# Altium schematic sheet Schematic1.schdoc
size 264 x 264 mm; Symbol: Drawing-Symbol_A4; Device: Drawing-Symbol_A4; @Project Name: AudioDeck; @Page Count: 1; @Update Date: 2026-04-30; @Create Date: 2026-04-28; @Schematic Name: Schematic1; @Page No: 1; @Page Name: P1; Company: EasyEDA.com; Version: V1.0; Page Size: A4; @Create Time: 20:01:22; @Update Time: 01:47:28; Width: 1000; Height: 1000; Region Start: 1; X Region Count: 6; Y Region Count: 4; Blade Width: 10; Title Block Position: 3; @Board Name: Board1
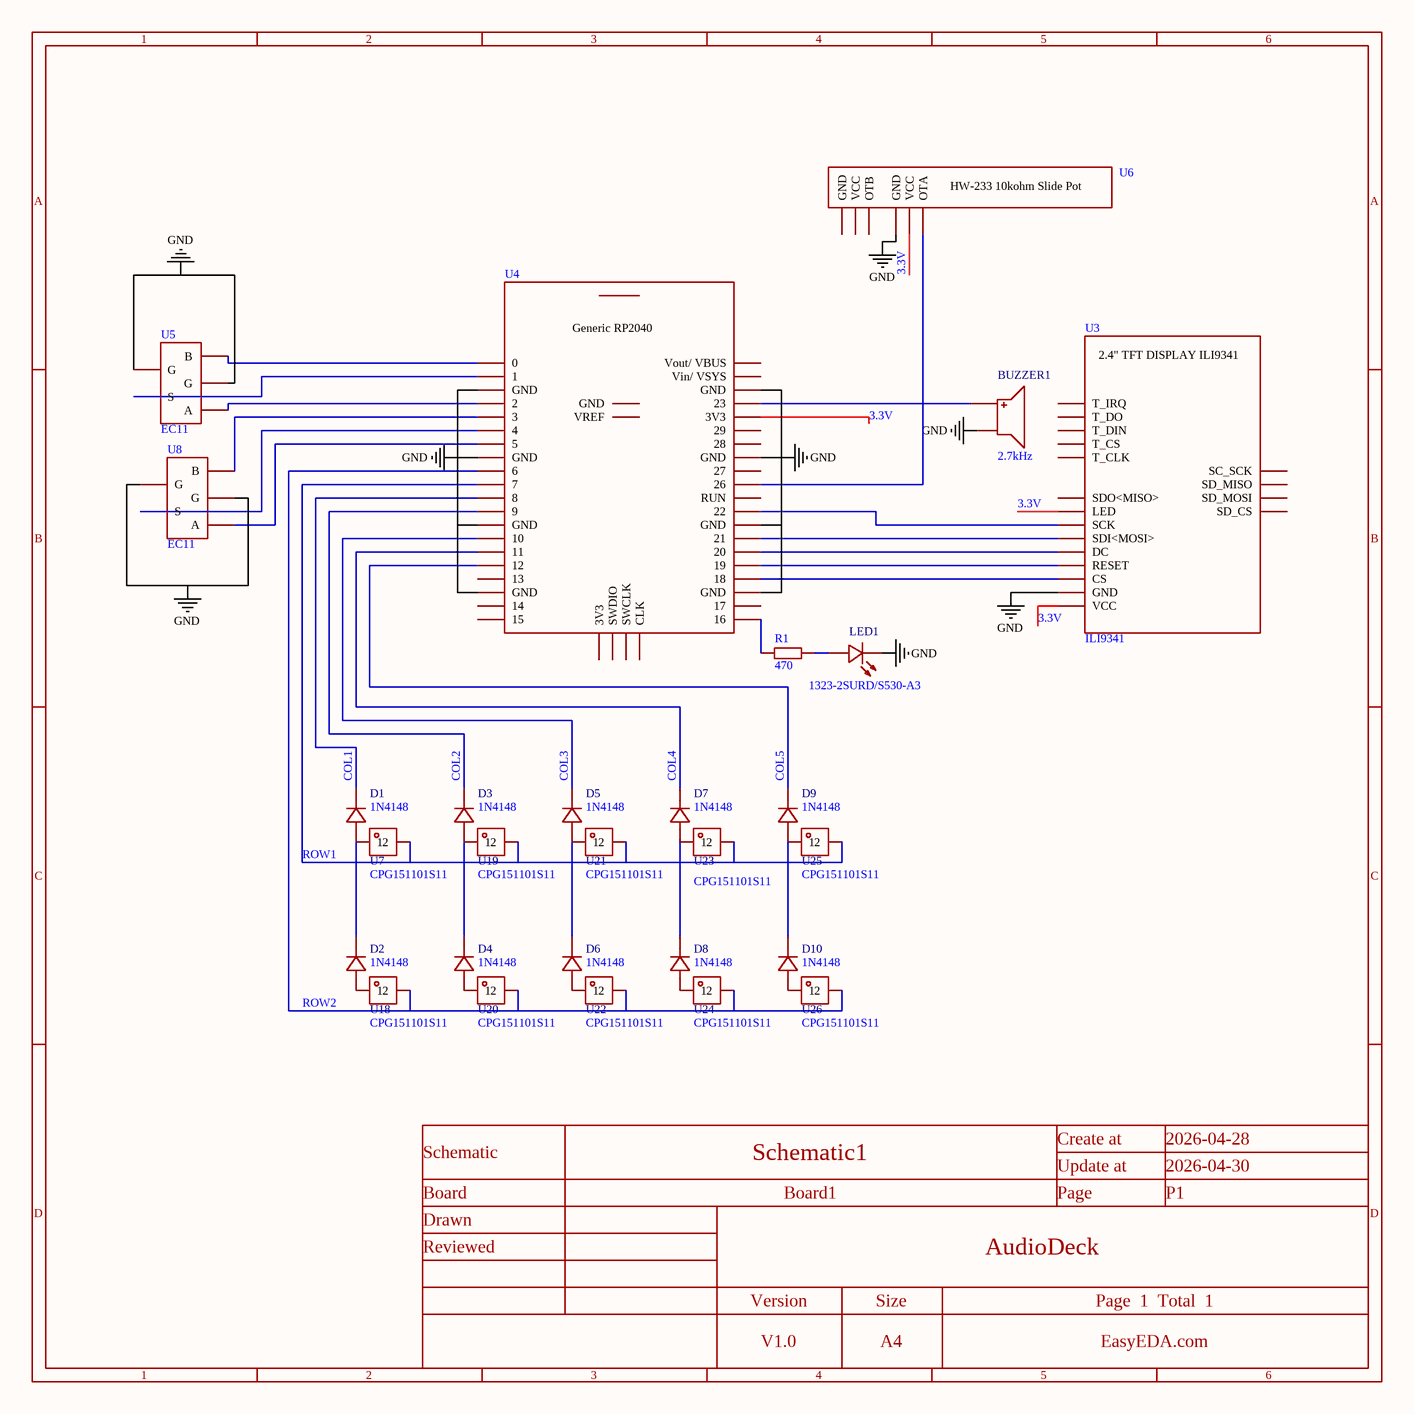
[diagram p0: Schematic1.schdoc]

## Parts
BUZZER1  2.7kHz  [BUZ-TH_BD9.0-P4.00-D0.6-FD]
D1  1N4148  [DO-35_BD1.7-L3.6-P10.00-D0.5-RD]
D2  1N4148  [DO-35_BD1.7-L3.6-P10.00-D0.5-RD]
D3  1N4148  [DO-35_BD1.7-L3.6-P10.00-D0.5-RD]
D4  1N4148  [DO-35_BD1.7-L3.6-P10.00-D0.5-RD]
D5  1N4148  [DO-35_BD1.7-L3.6-P10.00-D0.5-RD]
D6  1N4148  [DO-35_BD1.7-L3.6-P10.00-D0.5-RD]
D7  1N4148  [DO-35_BD1.7-L3.6-P10.00-D0.5-RD]
D8  1N4148  [DO-35_BD1.7-L3.6-P10.00-D0.5-RD]
D9  1N4148  [DO-35_BD1.7-L3.6-P10.00-D0.5-RD]
D10  1N4148  [DO-35_BD1.7-L3.6-P10.00-D0.5-RD]
LED1  1323-2SURD/S530-A3  [LED-TH_BD5.0-P2.54-L-RD]
R1  470  [R0603]
U3  ILI9341
U4  (no value)
U5  EC11
U6  (no value)
U7  CPG151101S11  [TH_L11.0-W5.9-KS-2P02B01-01]
U8  EC11
U18  CPG151101S11  [TH_L11.0-W5.9-KS-2P02B01-01]
U19  CPG151101S11  [TH_L11.0-W5.9-KS-2P02B01-01]
U20  CPG151101S11  [TH_L11.0-W5.9-KS-2P02B01-01]
U21  CPG151101S11  [TH_L11.0-W5.9-KS-2P02B01-01]
U22  CPG151101S11  [TH_L11.0-W5.9-KS-2P02B01-01]
U23  CPG151101S11  [TH_L11.0-W5.9-KS-2P02B01-01]
U24  CPG151101S11  [TH_L11.0-W5.9-KS-2P02B01-01]
U25  CPG151101S11  [TH_L11.0-W5.9-KS-2P02B01-01]
U26  CPG151101S11  [TH_L11.0-W5.9-KS-2P02B01-01]

## Nets
GND: BUZZER1.2 LED1.1(-) U3.2(GND) U4.3(GND) U4.8(GND) U4.13(GND) U4.18(GND) U4.23(GND) U4.28(GND) U4.33(GND) U4.38(GND) U5.1(G) U5.4(G) U6.4(GND) U8.1(G) U8.4(G)
3.3V: U3.1(VCC) U3.8(LED) U4.25(3V3) U6.5(VCC)
COL1: D1.1(C) U4.11(8)
COL2: D3.1(C) U4.12(9)
COL3: D5.1(C) U4.14(10)
COL4: D7.1(C) U4.15(11)
COL5: D9.1(C) U4.16(12)
ROW1: U4.10(7) U7.2 U19.2 U21.2 U23.2 U25.2
ROW2: U4.9(6) U18.2 U20.2 U22.2 U24.2 U26.2
NetBUZZER1_1: BUZZER1.1 U4.24(23)
NetD1_2: D1.2(A) D2.1(C) U7.1
NetD2_2: D2.2(A) U18.1
NetD3_2: D3.2(A) D4.1(C) U19.1
NetD4_2: D4.2(A) U20.1
NetD5_2: D5.2(A) D6.1(C) U21.1
NetD6_2: D6.2(A) U22.1
NetD7_2: D7.2(A) D8.1(C) U23.1
NetD8_2: D8.2(A) U24.1
NetD9_2: D9.2(A) D10.1(C) U25.1
NetD10_2: D10.2(A) U26.1
NetLED1_2: LED1.2(+) R1.2
NetR1_1: R1.1 U4.40(16)
NetU3_3: U3.3(CS) U4.37(18)
NetU3_4: U3.4(RESET) U4.36(19)
NetU3_5: U3.5(DC) U4.35(20)
NetU3_6: U3.6(SDI<MOSI>) U4.34(21)
NetU3_7: U3.7(SCK) U4.32(22)
NetU4_1: U4.1(0) U5.5(B)
NetU4_2: U4.2(1) U5.2(S)
NetU4_4: U4.4(2) U5.3(A)
NetU4_5: U4.5(3) U8.5(B)
NetU4_6: U4.6(4) U8.2(S)
NetU4_7: U4.7(5) U8.3(A)
NetU4_30: U4.30(26) U6.6(OTA)

Not connected (* = marked no-connect by the designer): U3 9(SDO<MISO>) 10(T_CLK) 11(T_CS) 12(T_DIN) 13(T_DO) 14(T_IRQ) 15(SD_CS) 16(SD_MOSI) 17(SD_MISO) 18(SC_SCK); U4 17(13) 19(14) 20(15) 21(Vout/_VBUS) 22(Vin/_VSYS) 26(29) 27(28) 29(27) 31(RUN) 39(17) 41(GND) 42(VREF) 43(3V3) 44(SWDIO) 45(SWCLK) 46(CLK); U6 1(GND) 2(VCC) 3(OTB)

## Notes on the sheet
- 1
- 2
- 3
- 4
- 5
- 6
- A
- B
- C
- Schematic
- Schematic1
- Create at
- Update at
- 2026-04-28
- 2026-04-30
- D
- Board
- Drawn
- Board1
- Page
- P1
- Reviewed
- Version
- Size
- AudioDeck
- Page  1  Total  1
- V1.0
- A4
- EasyEDA.com
- (in symbol HW-233 10k Slide Pot) HW-233 10kohm Slide Pot
- (in symbol ILI9341) 2.4" TFT DISPLAY ILI9341
- (in symbol RP2040-GENERIC-ALEXP) Generic RP2040

## Library data of the parts
BUZZER1 = QMB-09B-03: Manufacturer: 华能; Add into BOM: yes; Driver Circuitry: Passive (Externally Driven); Voltage - Supply: 2V~5V; Sound Pressure Level(SPL): 85dB; Symbol: QMB-09B-03; Device: QMB-09B-03; LCSC Part Name: 无源蜂鸣器QMB-09B-03; Supplier Part: C96256; Manufacturer Part: QMB-09B-03; Supplier Footprint: 插件,D=9mm; JLCPCB Part Class: Extended Part; Datasheet: https://item.szlcsc.com/datasheet/QMB-09B-03/97460.html; Supplier: LCSC; Convert to PCB: yes; Technology: Electromagnetic; Value: 2.7kHz; Diameter(φD): 9mm; Height: 5.7mm
D1-D10 = 1N4148_C22434654: Manufacturer: DIOTEC(德欧泰克); Add into BOM: yes; Pd - Power Dissipation: 500mW; Current - Rectified: 200mA; Voltage - DC Reverse(Vr): 75V; Voltage - Forward(Vf@If): 1V@10mA; Reverse Leakage Current (Ir): 5uA@75V; Operating Junction Temperature Range: -50℃~+175℃; Symbol: 1N4148_C22434654; Device: 1N4148_C22434654; LCSC Part Name: 1N4148; Supplier Part: C22434654; Manufacturer Part: 1N4148; Supplier Footprint: DO-35; JLCPCB Part Class: Extended Part; Datasheet: https://item.szlcsc.com/datasheet/1N4148/24058303.html; Supplier: LCSC; Convert to PCB: yes; Diode Configuration: -; Non-Repetitive Peak Forward Surge Current: -; Reverse Recovery Time (trr): -
LED1 = 1323-2SURD/S530-A3: Manufacturer: EVERLIGHT(亿光); Add into BOM: yes; Lamp Holder Type: 3mm round bulb; Symbol: 1323-2SURD/S530-A3; Device: 1323-2SURD/S530-A3; LCSC Part Name: 1323-2SURD/S530-A3; Supplier Part: C471419; Manufacturer Part: 1323-2SURD/S530-A3; Supplier Footprint: 插件,D=3mm; JLCPCB Part Class: Extended Part; Supplier: LCSC; Convert to PCB: yes
R1 = Res_0603: Symbol: Res; Convert to PCB: yes; Device: Res_0603; Add into BOM: yes; Supplier Footprint: 0603; Value: 470
U3 = ILI9341: Add into BOM: yes; Symbol: ILI9341; Device: ILI9341; Convert to PCB: yes
U4 = RP2040-GENERIC-ALEXP: Add into BOM: yes; Symbol: RP2040-GENERIC-ALEXP; Device: RP2040-GENERIC-ALEXP; Convert to PCB: yes
U5 U8 = Generic EC11 encoder: Add into BOM: yes; Symbol: Generic EC11 encoder; Device: Generic EC11 encoder; Convert to PCB: yes
U6 = HW-233 10k Slide Pot: Add into BOM: yes; Symbol: HW-233 10k Slide Pot; Device: HW-233 10k Slide Pot; Convert to PCB: yes
U7 U18-U26 = CPG151101S11: Add into BOM: yes; Symbol: CPG151101S11; Device: CPG151101S11; LCSC Part Name: CPG151101S11; Supplier Part: C9900013508; Manufacturer Part: CPG151101S11; Supplier Footprint: CherryMX_KailhSocket:MXOnly-1U-Hotswap; JLCPCB Part Class: Extended Part; Supplier: LCSC; Convert to PCB: yes